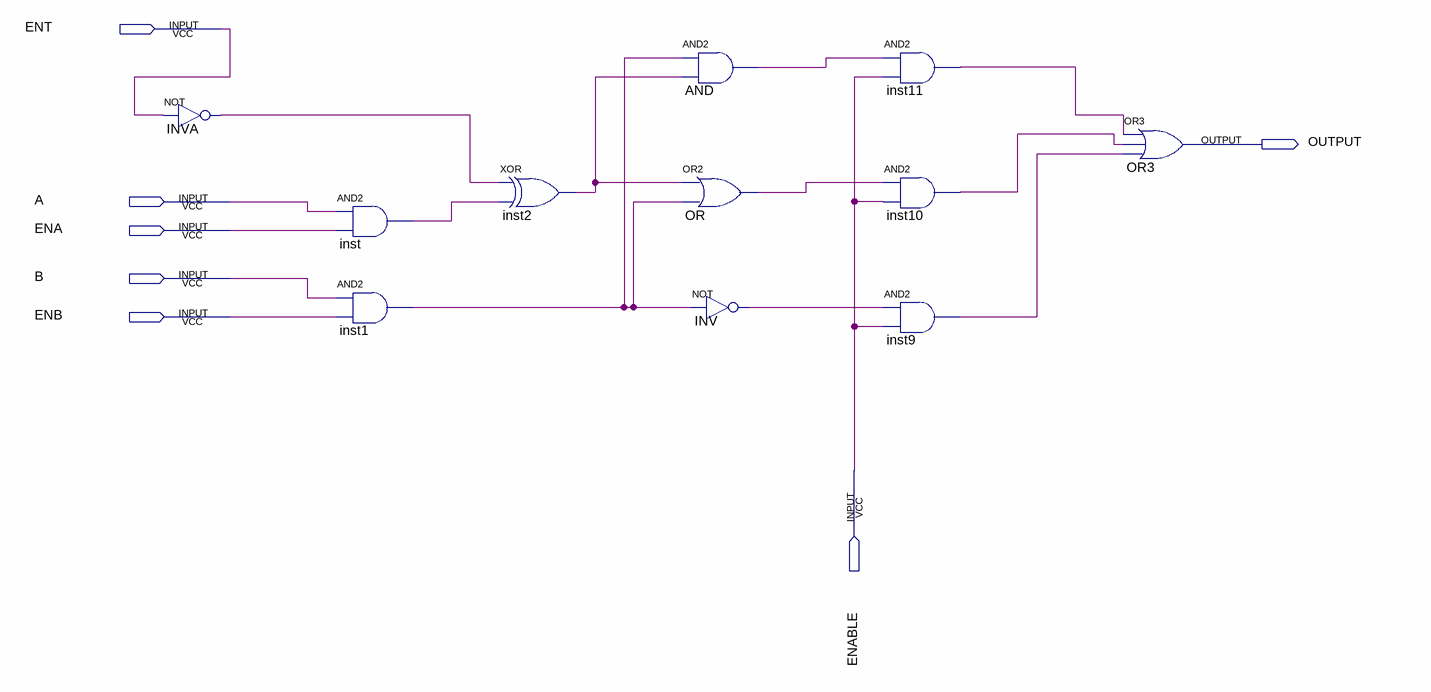
[diagram p0: schematic sheet]
// Quartus schematic LOGICAL_UNIT.bdf as structural Verilog: 11 symbols, 7 pins
module LOGICAL_UNIT (
  input  ENT,
  input  A,
  input  ENA,
  input  B,
  input  ENB,
  input  ENABLE,
  output OUTPUT
);

  wire AND_out, inst1_out, inst2_out, inst9_out, inst10_out, inst11_out, inst_out, INV_out, INVA_out, OR_out;

  not INVA (INVA_out, ENT);
  and inst (inst_out, A, ENA);
  and inst1 (inst1_out, B, ENB);
  xor inst2 (inst2_out, INVA_out, inst_out);
  and AND (AND_out, inst1_out, inst2_out);
  or OR (OR_out, inst2_out, inst1_out);
  not INV (INV_out, inst1_out);
  and inst11 (inst11_out, AND_out, ENABLE);
  and inst10 (inst10_out, OR_out, ENABLE);
  and inst9 (inst9_out, INV_out, ENABLE);
  or OR3 (OUTPUT, inst11_out, inst10_out, inst9_out);
endmodule
